# EAGLE design uino-1284p (EAGLE 7.7.0)
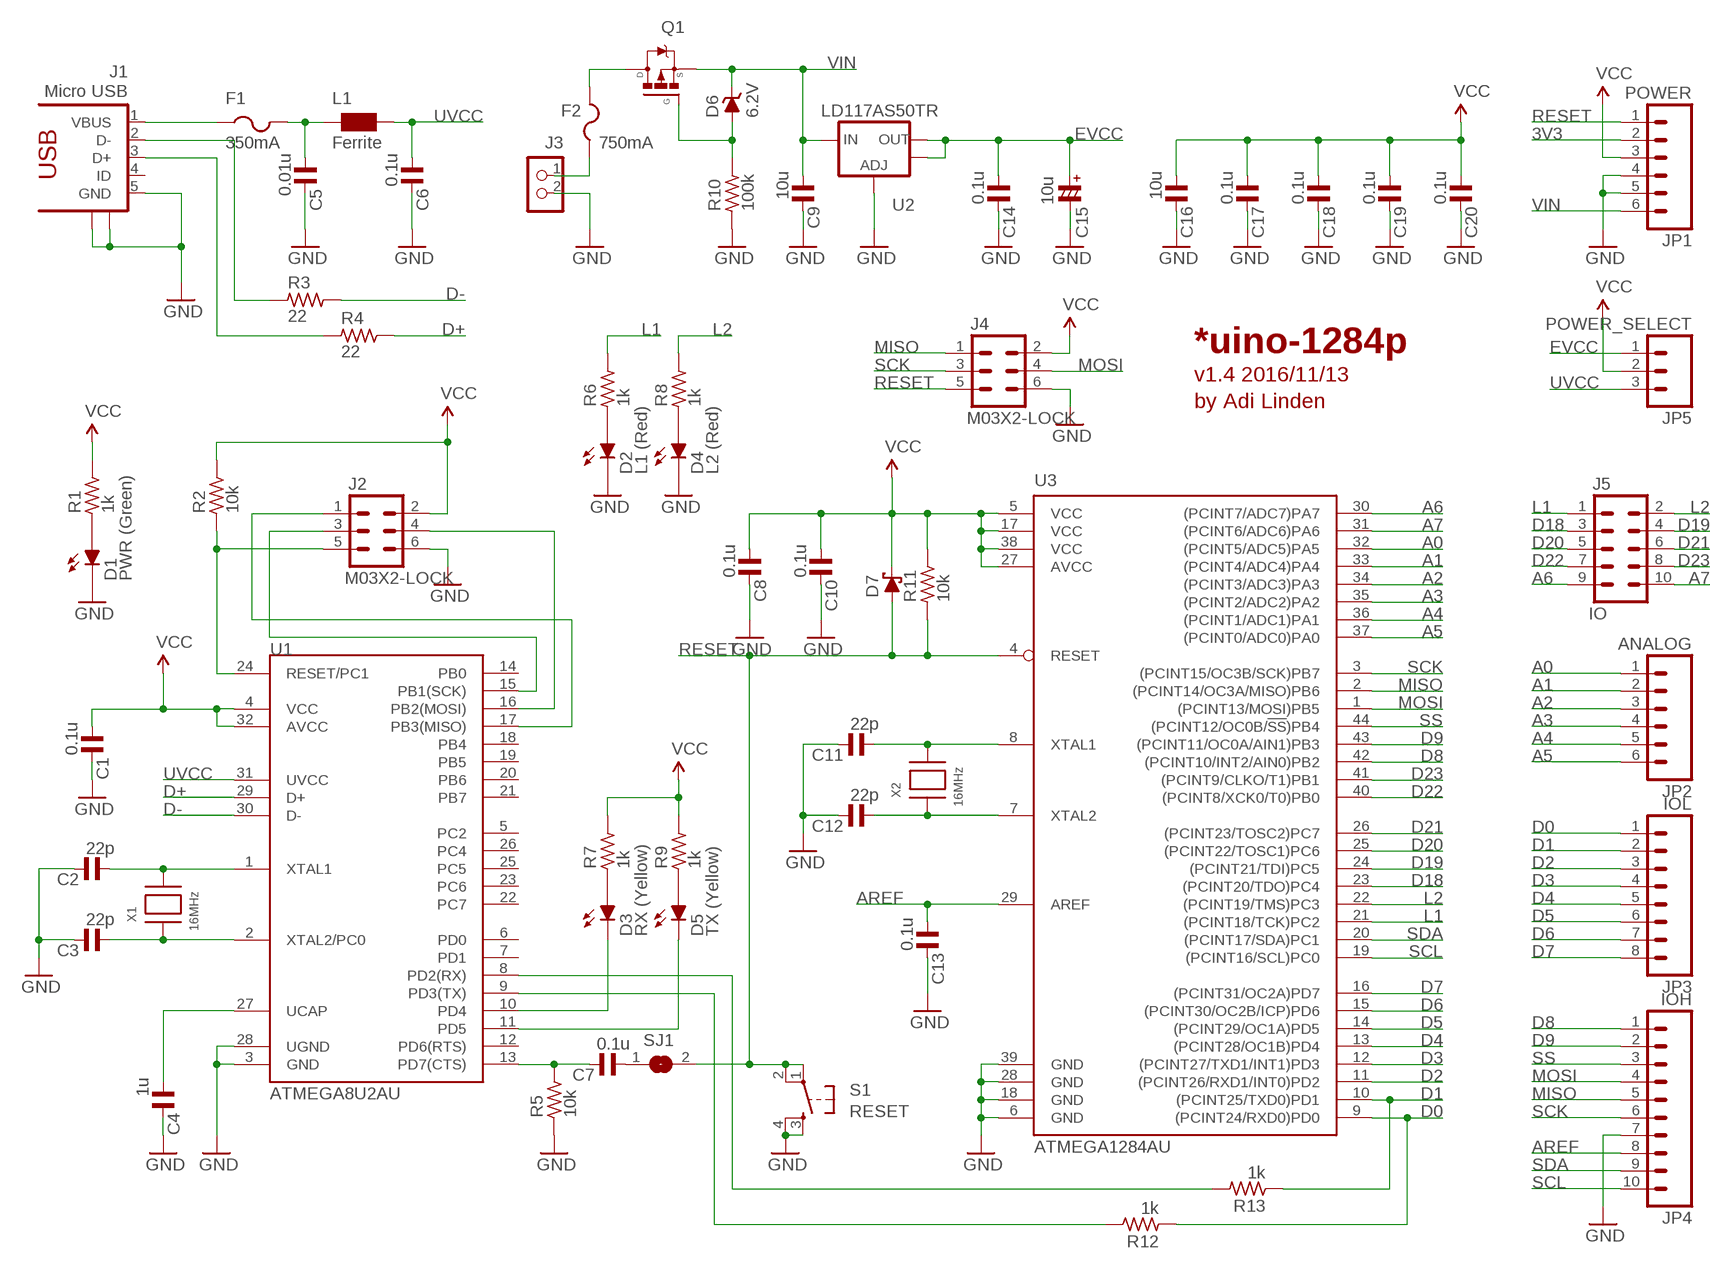
[diagram p0: schematic, sheet 1]

## Parts
C1  0.1u  C_0805MP  [C0805MP]
C2  22p  C_0805MP  [C0805MP]
C3  22p  C_0805MP  [C0805MP]
C4  1u  C_0805MP  [C0805MP]
C5  0.01u  C_0805MP  [C0805MP]
C6  0.1u  C_0805MP  [C0805MP]
C7  0.1u  C_0805MP  [C0805MP]
C8  0.1u  C_0805MP  [C0805MP]
C9  10u  C_0805MP  [C0805MP]
C10  0.1u  C_0805MP  [C0805MP]
C11  22p  C_0805MP  [C0805MP]
C12  22p  C_0805MP  [C0805MP]
C13  0.1u  C_0805MP  [C0805MP]
C14  0.1u  C_0805MP  [C0805MP]
C15  10u  CP_0805MP/T  [C0805MP/T]
C16  10u  C_0805MP  [C0805MP]
C17  0.1u  C_0805MP  [C0805MP]
C18  0.1u  C_0805MP  [C0805MP]
C19  0.1u  C_0805MP  [C0805MP]
C20  0.1u  C_0805MP  [C0805MP]
D1  PWR (Green)  LEDCHIP-LED0805MP  [CHIP-LED0805MP]
D2  L1 (Red)  LEDCHIP-LED0805MP  [CHIP-LED0805MP]
D3  RX (Yellow)  LEDCHIP-LED0805MP  [CHIP-LED0805MP]
D4  L2 (Red)  LEDCHIP-LED0805MP  [CHIP-LED0805MP]
D5  TX (Yellow)  LEDCHIP-LED0805MP  [CHIP-LED0805MP]
D6  6.2V  BZX384  [SOD323]
D7  SCHOTTKY-DIODESOD323  [SOD323]
F1  350mA  PTCFUSE-0805  [R0805]
F2  750mA  PTCFUSE-0805  [R0805]
J1  Micro USB  USB_MICRO_B_2.0-TH  [ZX62D-AB-5P8]
J2  M03X2-LOCK  [2X03_LOCK]
J3  CON_TERMINAL_BLOCK_02-5MM  [TERMINAL_BLOCK_2P_5]
J4  M03X2-LOCK  [2X03_LOCK]
J5  IO  M05X2  [2X05]
JP1  POWER  M06SIP  [1X06]
JP2  ANALOG  M06SIP  [1X06]
JP3  IOL  M081X08  [1X08]
JP4  IOH  M101X10  [1X10]
JP5  POWER_SELECT  M03PTH  [1X03]
L1  Ferrite  WE-CBF_0805  [0805]
Q1  MMBF0202PLT1  [SOT23]
R1  1k  R_0805MP  [R0805MP]
R2  10k  R_0805MP  [R0805MP]
R3  22  R_0805MP  [R0805MP]
R4  22  R_0805MP  [R0805MP]
R5  10k  R_0805MP  [R0805MP]
R6  1k  R_0805MP  [R0805MP]
R7  1k  R_0805MP  [R0805MP]
R8  1k  R_0805MP  [R0805MP]
R9  1k  R_0805MP  [R0805MP]
R10  100k  R_0805MP  [R0805MP]
R11  10k  R_0805MP  [R0805MP]
R12  1k  R_0805MP  [R0805MP]
R13  1k  R_0805MP  [R0805MP]
S1  RESET  TAC_SWITCHSMD  [TACTILE_SWITCH_SMD]
SJ1  SJ  [SJ]
U1  ATMEGA8U2AU  [TQFP32-08]
U2  LD117AS50TR  V_REG_LM1117SOT223  [SOT223]
U3  ATMEGA1284AU  ATMEGA1284P-AU  [TQFP44]
X1  16MHz  XTALNX5032  [NX5032]
X2  16MHz  XTALNX5032  [NX5032]

## Nets
3V3: JP1.2
A0: JP2.1 U3.32((PCINT5/ADC5)PA5)
A1: JP2.2 U3.33((PCINT4/ADC4)PA4)
A2: JP2.3 U3.34((PCINT3/ADC3)PA3)
A3: JP2.4 U3.35((PCINT2/ADC2)PA2)
A4: JP2.5 U3.36((PCINT1/ADC1)PA1)
A5: JP2.6 U3.37((PCINT0/ADC0)PA0)
A6: J5.9 U3.30((PCINT7/ADC7)PA7)
A7: J5.10 U3.31((PCINT6/ADC6)PA6)
AREF: C13.1 JP4.8 U3.29(AREF)
D0: JP3.1 R12.1 U3.9((PCINT24/RXD0)PD0)
D1: JP3.2 R13.1 U3.10((PCINT25/TXD0)PD1)
D2: JP3.3 U3.11((PCINT26/RXD1/INT0)PD2)
D3: JP3.4 U3.12((PCINT27/TXD1/INT1)PD3)
D4: JP3.5 U3.13((PCINT28/OC1B)PD4)
D5: JP3.6 U3.14((PCINT29/OC1A)PD5)
D6: JP3.7 U3.15((PCINT30/OC2B/ICP)PD6)
D7: JP3.8 U3.16((PCINT31/OC2A)PD7)
D8: JP4.1 U3.42((PCINT10/INT2/AIN0)PB2)
D9: JP4.2 U3.43((PCINT11/OC0A/AIN1)PB3)
D18: J5.3 U3.23((PCINT20/TDO)PC4)
D19: J5.4 U3.24((PCINT21/TDI)PC5)
D20: J5.5 U3.25((PCINT22/TOSC1)PC6)
D21: J5.6 U3.26((PCINT23/TOSC2)PC7)
D22: J5.7 U3.40((PCINT8/XCK0/T0)PB0)
D23: J5.8 U3.41((PCINT9/CLKO/T1)PB1)
D+: R4.2 U1.29(D+)
D-: R3.2 U1.30(D-)
EVCC: C14.1 C15.+ JP5.1 U2.2(OUT) U2.4(OUT)
GND: C1.2 C2.2 C3.2 C4.2 C5.2 C6.2 C8.2 C9.2 C10.2 C11.2 C12.2 C13.2 C14.2 C15.- C16.2 C17.2 C18.2 C19.2 C20.2 D1.C D2.C D4.C J1.5(GND) J1.S1 J1.S2 J2.6 J3.2 J4.6 JP1.4 JP1.5 JP4.7 R5.1 R10.1 S1.3 S1.4 U1.3(GND) U1.28(UGND) U2.1(ADJ) U3.6(GND) U3.18(GND) U3.28(GND) U3.39(GND)
L1: J5.1 R6.2 U3.21((PCINT18/TCK)PC2)
L2: J5.2 R8.2 U3.22((PCINT19/TMS)PC3)
MISO: J4.1 JP4.5 U3.2((PCINT14/OC3A/MISO)PB6)
MOSI: J4.4 JP4.4 U3.1((PCINT13/MOSI)PB5)
N$1: F2.2 Q1.3(D)
N$2: C5.1 F1.2 L1.1
N$3: C7.1 SJ1.1
N$4: J1.2(D-) R3.1
N$5: J1.3(D+) R4.1
N$6: R12.2 U1.9(PD3(TX))
N$7: R13.2 U1.8(PD2(RX))
N$8: C2.1 U1.1(XTAL1) X1.P$2
N$9: C3.1 U1.2(XTAL2/PC0) X1.P$1
N$10: C4.1 U1.27(UCAP)
N$11: D2.A R6.1
N$12: D4.A R8.1
N$13: J2.1 U1.17(PB3(MISO))
N$14: J2.3 U1.15(PB1(SCK))
N$15: J2.5 R2.1 U1.24(RESET/PC1)
N$16: J2.4 U1.16(PB2(MOSI))
N$17: F2.1 J3.1
N$18: D6.A Q1.1(G) R10.2
N$23: C11.1 U3.8(XTAL1) X2.P$2
N$24: C12.1 U3.7(XTAL2) X2.P$1
N$26: D3.A R7.1
N$27: D5.A R9.1
N$29: D3.C U1.10(PD4)
N$30: D5.C U1.11(PD5)
N$31: C7.2 R5.2 U1.13(PD7(CTS))
N$34: D1.A R1.1
RESET: D7.A J4.5 JP1.1 R11.1 S1.1 S1.2 SJ1.2 U3.4(RESET)
SCK: J4.3 JP4.6 U3.3((PCINT15/OC3B/SCK)PB7)
SCL: JP4.10 U3.19((PCINT16/SCL)PC0)
SDA: JP4.9 U3.20((PCINT17/SDA)PC1)
SS: JP4.3 U3.44((PCINT12/OC0B/!SS!)PB4)
UVCC: C6.1 JP5.3 L1.2 U1.31(UVCC)
VBUS: F1.1 J1.1(VBUS)
VCC: C1.1 C8.1 C10.1 C16.1 C17.1 C18.1 C19.1 C20.1 D7.C J2.2 J4.2 JP1.3 JP5.2 R1.2 R2.2 R7.2 R9.2 R11.2 U1.4(VCC) U1.32(AVCC) U3.5(VCC) U3.17(VCC) U3.27(AVCC) U3.38(VCC)
VIN: C9.1 D6.C JP1.6 Q1.2(S) U2.3(IN)
Unconnected: J1.4(ID) U1.5(PC2) U1.6(PD0) U1.7(PD1) U1.12(PD6(RTS)) U1.14(PB0) U1.18(PB4) U1.19(PB5) U1.20(PB6) U1.21(PB7) U1.22(PC7) U1.23(PC6) U1.25(PC5) U1.26(PC4)

## Notes on the sheet
- *uino-1284p
- v1.4 2016/11/13
- by Adi Linden

## Library data of the parts
C1-C14 C16-C20 = rc-master-smd:C_: NON-POLARIZED CAP
C15 = rc-master-smd:CP_: POLARIZED CAP
D1-D5 = led:LED: LED Various Types
D6 = diode:BZX384*: ZENER DIODE BZX384
D7 = diode:SCHOTTKY-DIODE: Schottky Diode
F1 F2 = adilinden:PTCFUSE: PTC fuses, resettable thermistors
J1 = adi-misc:USB_MICRO_B_2.0-TH: USB Micro AB OTG Receptacle Hirose ZX62D-AB-5P8 Amphenol FCI 10118194-0001LF
J2 J4 = adi-misc:M03X2: This is a 3x2 pin header Note: This part is based on the Sparkfun M04X2 header.
J3 = adi-misc:CON_TERMINAL_BLOCK_02: 2 poles wire to board terminal block
J5 = adilinden:M05X2
JP1 JP2 = SparkFun:M06: Header 6 Standard 6-pin 0.1" header. Use with straight break away headers (SKU : PRT-00116), right angle break away headers (PRT-00553), swiss pins (PRT-00743), machine pins (PRT-00117), and female headers (PRT-00115). Molex polarized connector foot print use with SKU : PRT-08094 with associated crimp pins and housings. NOTES ON THE VARIANTS LOCK and LOCK_LONGPADS... This footprint was designed to help hold the alignment of a through-hole component (i.e. 6-pin header) while soldering it into place. You may notice that each hole has been shifted either up or down by 0.005 of an inch from it's more standard position (which is a perfectly straight line). This slight alteration caused the pins (the squares in the middle) to touch the edges of the holes. Because they are alternating, it causes a "brace" to hold the component in place. 0.005 has proven to be the perfect amount of "off-center" position when using our standard breakaway headers. Although looks a little odd when you look at the bare footprint, once you have a header in there, the alteration is very hard to notice. Also, if you push a header all the way into place, it is covered up entirely on the bottom side. This idea of altering the position of holes to aid alignment will be further integrated into the Sparkfun Library for other footprints. It can help hold any component with 3 or more connection pins.
JP3 = SparkFun:M08: Header 8 Standard 8-pin 0.1" header. Use with straight break away headers (SKU : PRT-00116), right angle break away headers (PRT-00553), swiss pins (PRT-00743), machine pins (PRT-00117), and female headers (PRT-00115).
JP4 = adilinden:M10: Header 10 Standard 10-pin 0.1" header. Use with straight break away headers (SKU : PRT-00116), right angle break away headers (PRT-00553), swiss pins (PRT-00743), machine pins (PRT-00117), and female headers (PRT-00115). Note: This part is based on the Sparkfun M08 library part.
JP5 = SparkFun:M03: Header 3 Standard 3-pin 0.1" header. Use with straight break away headers (SKU : PRT-00116), right angle break away headers (PRT-00553), swiss pins (PRT-00743), machine pins (PRT-00117), and female headers (PRT-00115). Molex polarized connector foot print use with SKU : PRT-08232 with associated crimp pins and housings.
L1 = wuerth-elektronik:WE-CBF: SMD EMI Suppression Ferrite Beads - excellent anti-EMI properties - low DCR - impedances till 3000 ohms - rated current up to 6 A
Q1 = transistor-fet:MMBF0202P*: P-Channel Power MOSFET
R1-R13 = rc-master-smd:R_: RESISTOR
S1 = SparkFun:TAC_SWITCH: Momentary Switch Button commonly used for reset or general input. Spark Fun Electronics SKU : COM-00097
SJ1 = jumper:SJ: SMD solder JUMPER
U1 = SparkFun:ATMEGA8U2: Atmel 8-bit Microcontroller with 8/16/32K Bystes of ISP Flash and USB Controller. ATmega8U2, ATmega16U2, and ATmega32U2
U2 = adi-misc:V_REG_LM1117: Voltage Regulator LM1117 Standard adjustable voltage regulator but in SMD form. Spark Fun Electronics SKU : COM-00595
U3 = adi-atmega:ATMEGA1284P: 8-bit Microcontroller with 64K Bytes In-System Programmable Flash Source: http://www.atmel.com/dyn/resources/prod_documents/doc2593.pdf; MPN: ATMEGA644PV-10AU; OC_FARNELL: 1455123; OC_NEWARK: 58M3748
X1 X2 = adafruit:XTAL: Low cost SMT crystals, no capacitors included http://www.ladyada.net/library/eagle

## Board
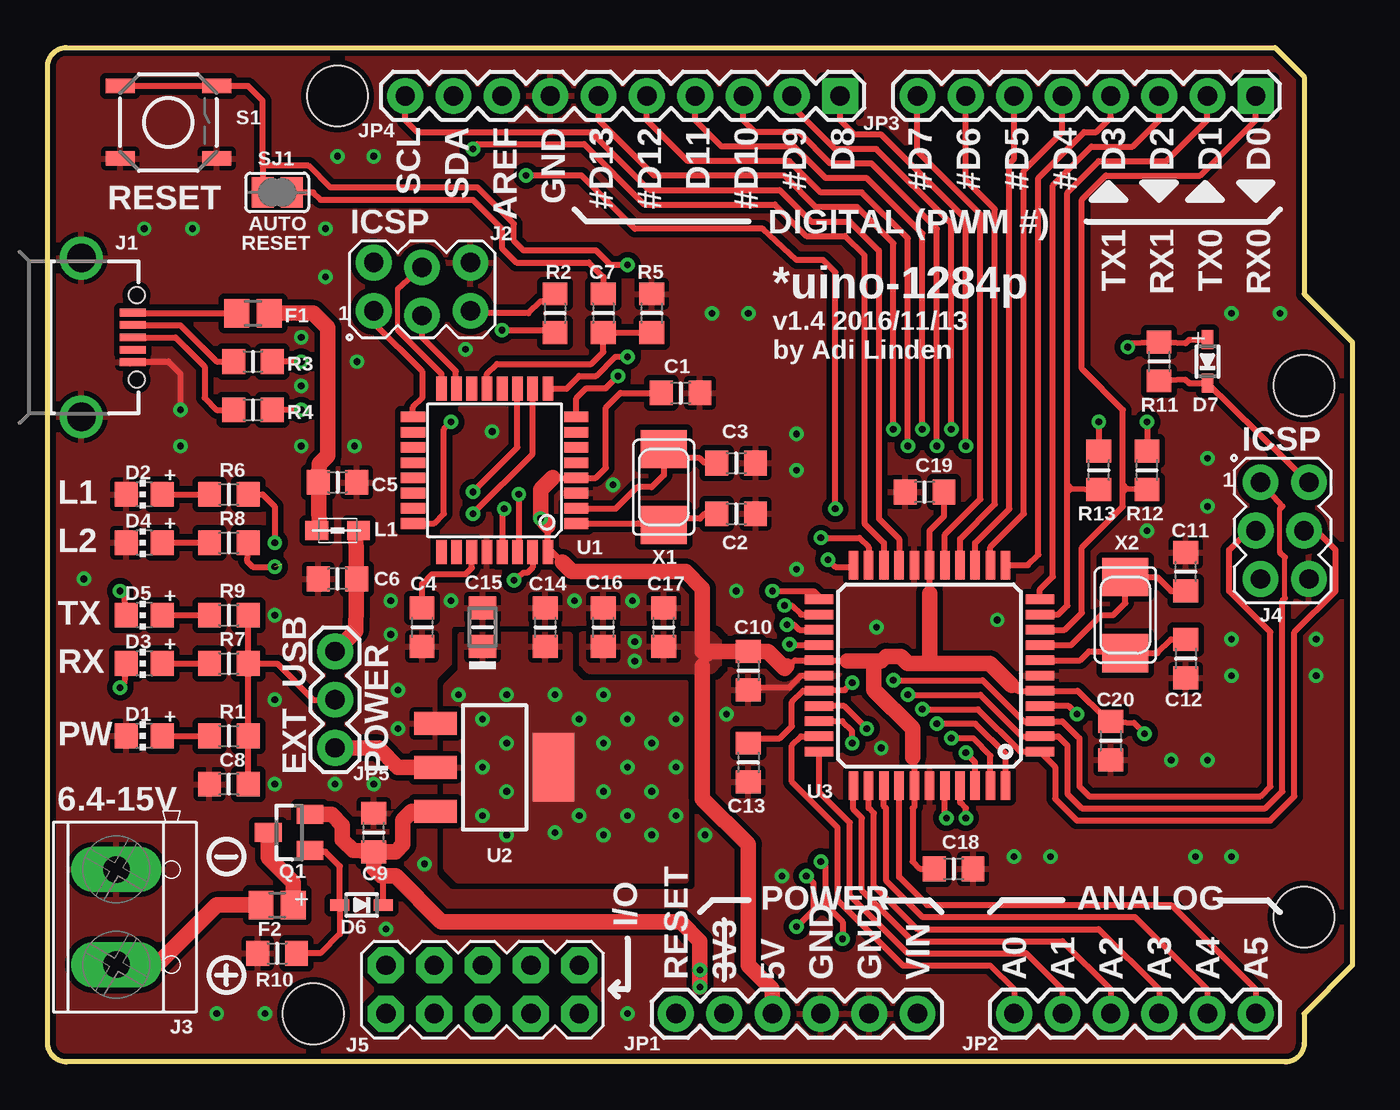
[diagram p1: board, top side]
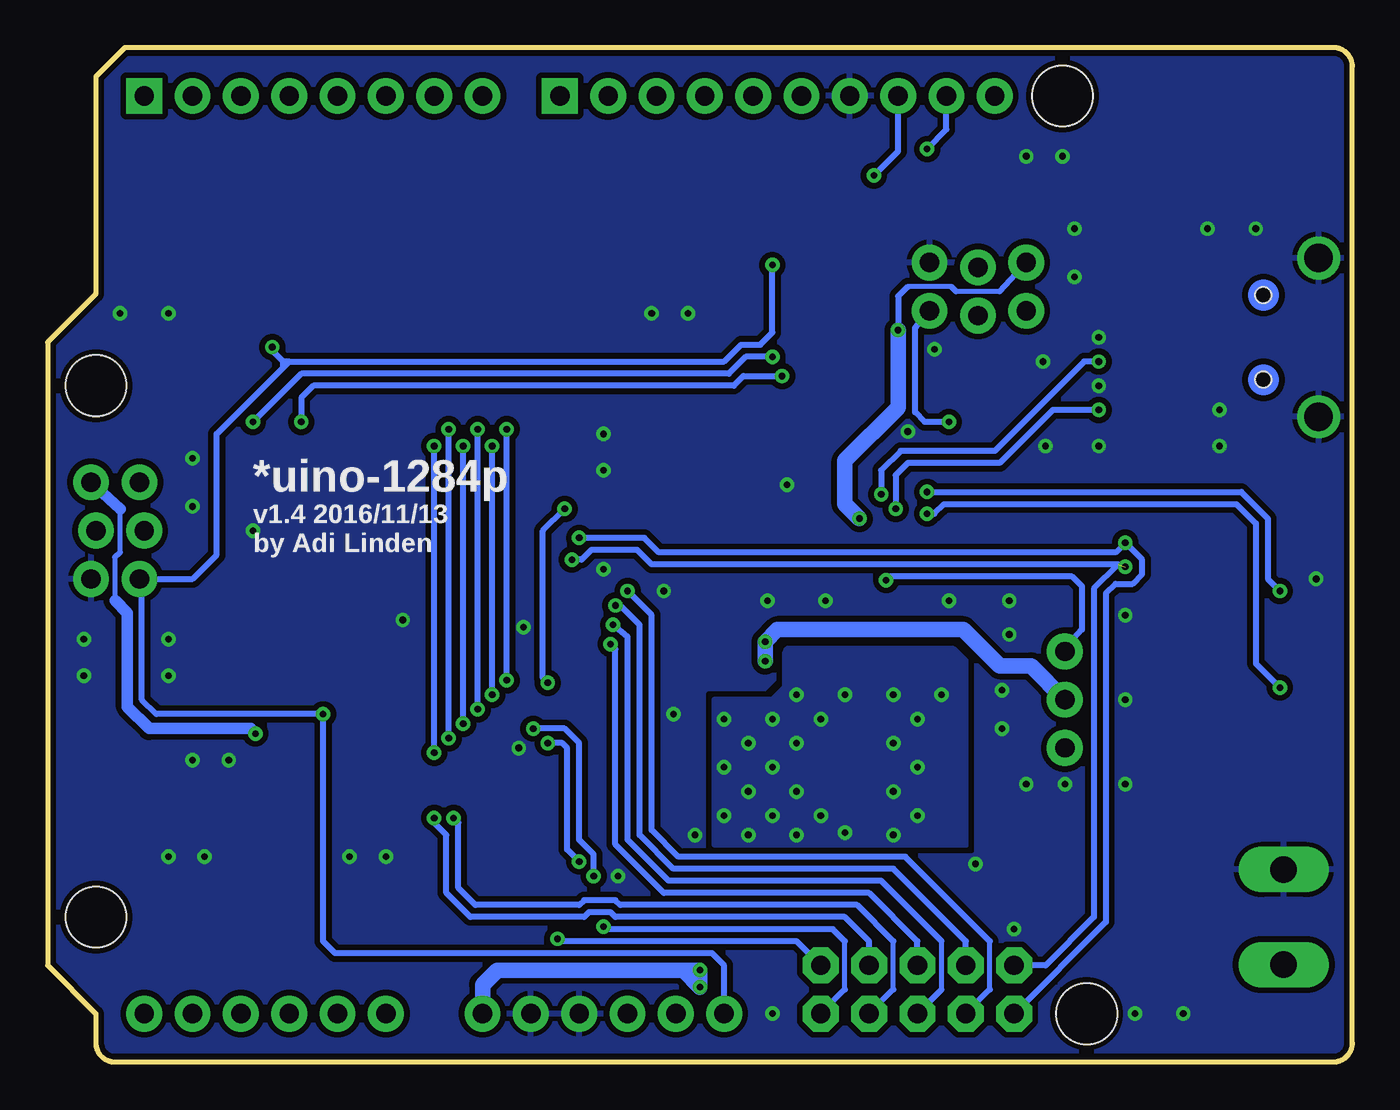
[diagram p2: board, bottom side, seen from below]

Size 68.58 x 53.34 mm. Coordinates in mm from the lower left corner, seen from the top.
Outline: 64.52,53.34 66.04,51.82 66.04,40.39 68.58,37.85 68.58,5.08 66.04,2.54 66.04,1 arc-90 65.04,0 1,0 arc-90 0,1 0,52.34 arc-90 1,53.34 64.52,53.34
Copper layers (1*16): Top 0.035mm / dielectric 1.5mm / Bottom 0.035mm
Design rules "SeeedStudio_2layer_DRU_no_angle_20140221 *": minimum track width 6mil, minimum drill 12mil, track to track 6mil, track to pad 6mil, pad to pad 6mil, via to via 6mil, smd to smd 0mil, copper to edge 10mil, drill to drill 10mil, minimum pad ring 10mil, minimum via ring 8mil, stop-mask expansion 2mil, vias tented up to drill 25mil, thermal gap 10mil
Holes 3.2 mm at 66.04,35.56 66.04,7.62 15.24,50.8 13.97,2.54

### Footprints (pad centres in the part's own frame; a part is rotated, then mirrored left to right if it is on the bottom)
C0805MP = smd 1.2 x 1.3: 1 -1.016,0; 2 1.016,0
C0805MP/T = smd 1.2 x 1.45: + 1.016,0; - -1.016,0
CHIP-LED0805MP = smd 1.3 x 1.2: A 0,-0.953; C 0,0.953
SOD323 = smd 1 x 0.6: A 1.143,0; C -1.143,0
R0805 = smd 1.3 x 1.5: 1 -0.85,0; 2 0.85,0
ZX62D-AB-5P8 = smd 0.4 x 1.35: 1 -1.3,2.7; 2 -0.65,2.7; 3 0,2.7; 4 0.65,2.7; 5 1.3,2.7 | drill 1.5: S1 -4.175,0; S2 4.175,0 | hole 0.85: -2.225,2.9; 2.225,2.9
2X03_LOCK = drill 1.016 pad 1.88: 1 -2.54,-1.143; 2 -2.54,1.397; 3 0,-1.397; 4 0,1.143; 5 2.54,-1.143; 6 2.54,1.397
TERMINAL_BLOCK_2P_5 = drill 1.4 pad 2.38 long: 1 2.5,-0.45; 2 -2.5,-0.45
2X05 = drill 1.016 pad 1.88 octagon: 1 -5.08,-1.27; 2 -5.08,1.27; 3 -2.54,-1.27; 4 -2.54,1.27; 5 0,-1.27; 6 0,1.27; 7 2.54,-1.27; 8 2.54,1.27; 9 5.08,-1.27; 10 5.08,1.27
1X06 = drill 1.016 pad 1.88: 1 0,0; 2 2.54,0; 3 5.08,0; 4 7.62,0; 5 10.16,0; 6 12.7,0
1X08 = drill 1.016 pad 1.88 square: 1 0,0 | drill 1.016 pad 1.88: 2 2.54,0; 3 5.08,0; 4 7.62,0; 5 10.16,0; 6 12.7,0; 7 15.24,0; 8 17.78,0
1X10 = drill 1.016 pad 1.88 square: 1 0,0 | drill 1.016 pad 1.88: 2 2.54,0; 3 5.08,0; 4 7.62,0; 5 10.16,0; 6 12.7,0; 7 15.24,0; 8 17.78,0; 9 20.32,0; 10 22.86,0
1X03 = drill 1.016 pad 1.88: 1 0,0; 2 2.54,0; 3 5.08,0
0805 = smd 1.2 x 1: 1 -1.1,0; 2 1.1,0
SOT23 = smd 1 x 1.4: 1 -0.95,-1.1; 2 0.95,-1.1; 3 0,1.1
R0805MP = smd 1.2 x 1.3: 1 -1.016,0; 2 1.016,0
TACTILE_SWITCH_SMD = smd 1.524 x 0.762: 1 -2.54,1.905; 2 2.54,1.905; 3 -2.54,-1.905; 4 2.54,-1.905
SJ = smd 1.168 x 1.6: 1 -0.762,0; 2 0.762,0
TQFP32-08 = smd 1.27 x 0.559: 1 -4.293,2.8; 2 -4.293,2; 3 -4.293,1.2; 4 -4.293,0.4; 5 -4.293,-0.4; 6 -4.293,-1.2; 7 -4.293,-2; 8 -4.293,-2.8; 17 4.293,-2.8; 18 4.293,-2; 19 4.293,-1.2; 20 4.293,-0.4; 21 4.293,0.4; 22 4.293,1.2; 23 4.293,2; 24 4.293,2.8 | smd 0.559 x 1.27: 9 -2.8,-4.293; 10 -2,-4.293; 11 -1.2,-4.293; 12 -0.4,-4.293; 13 0.4,-4.293; 14 1.2,-4.293; 15 2,-4.293; 16 2.8,-4.293; 25 2.8,4.293; 26 2,4.293; 27 1.2,4.293; 28 0.4,4.293; 29 -0.4,4.293; 30 -1.2,4.293; 31 -2,4.293; 32 -2.8,4.293
SOT223 = smd 1.219 x 2.235: 1 -2.311,-3.099; 2 0,-3.099; 3 2.311,-3.099 | smd 3.6 x 2.2: 4 0,3.099
TQFP44 = smd 1.5 x 0.5: 1 -5.8,4; 2 -5.8,3.2; 3 -5.8,2.4; 4 -5.8,1.6; 5 -5.8,0.8; 6 -5.8,0; 7 -5.8,-0.8; 8 -5.8,-1.6; 9 -5.8,-2.4; 10 -5.8,-3.2; 11 -5.8,-4; 23 5.8,-4; 24 5.8,-3.2; 25 5.8,-2.4; 26 5.8,-1.6; 27 5.8,-0.8; 28 5.8,0; 29 5.8,0.8; 30 5.8,1.6; 31 5.8,2.4; 32 5.8,3.2; 33 5.8,4 | smd 0.5 x 1.5: 12 -4,-5.8; 13 -3.2,-5.8; 14 -2.4,-5.8; 15 -1.6,-5.8; 16 -0.8,-5.8; 17 0,-5.8; 18 0.8,-5.8; 19 1.6,-5.8; 20 2.4,-5.8; 21 3.2,-5.8; 22 4,-5.8; 34 4,5.8; 35 3.2,5.8; 36 2.4,5.8; 37 1.6,5.8; 38 0.8,5.8; 39 0,5.8; 40 -0.8,5.8; 41 -1.6,5.8; 42 -2.4,5.8; 43 -3.2,5.8; 44 -4,5.8
NX5032 = smd 2 x 2.4: P$1 2,0; P$2 -2,0

### Placement (x,y rotation side)
C1  33.27,35.18 0 top
C2  36.2,28.83 0 top
C3  36.2,31.5 0 top
C4  19.68,22.86 270 top
C5  15.24,30.48 0 top
C6  15.24,25.4 180 top
C7  29.21,39.37 270 top
C8  9.53,14.61 180 top
C9  17.14,12.06 90 top
C10  36.83,20.57 270 top
C11  59.82,25.78 90 top
C12  59.82,21.21 270 top
C13  36.83,15.75 270 top
C14  26.16,22.86 90 top
C15  22.86,22.86 270 top
C16  29.21,22.86 90 top
C17  32.38,22.86 90 top
C18  47.62,10.16 0 top
C19  46.1,29.97 180 top
C20  55.88,16.89 270 top
D1  5.08,17.14 90 top
D2  5.08,29.84 90 top
D3  5.08,20.95 90 top
D4  5.08,27.3 90 top
D5  5.08,23.5 90 top
D6  16.51,8.26 180 top
D7  60.96,36.83 90 top
F1  10.79,39.37 0 top
F2  12.06,8.26 0 top
J1  1.78,38.1 270 top
J2  19.68,40.64 0 top
J3  4.06,7.62 270 top
J4  64.9,27.94 270 top
J5  22.86,3.81 0 top
JP1  33.02,2.54 0 top
JP2  50.8,2.54 0 top
JP3  63.5,50.8 180 top
JP4  41.66,50.8 180 top
JP5  15.11,16.51 90 top
L1  15.24,27.94 0 top
Q1  12.7,12.06 90 top
R1  9.53,17.14 0 top
R2  26.67,39.37 270 top
R3  10.79,36.83 0 top
R4  10.79,34.29 0 top
R5  31.75,39.37 270 top
R6  9.53,29.84 0 top
R7  9.53,20.95 0 top
R8  9.53,27.3 0 top
R9  9.53,23.5 0 top
R10  12.06,5.71 0 top
R11  58.42,36.83 270 top
R12  57.78,31.11 90 top
R13  55.24,31.11 90 top
S1  6.35,49.4 0 top
SJ1  12.06,45.72 180 top
U1  23.5,31.11 180 top
U2  23.5,15.49 270 top
U3  46.35,20.32 180 top
X1  32.38,30.23 90 top
X2  56.64,23.5 270 top

### Tracks (layer width: path | path; a pad name or v marks a point on that pad's centre or on a via)
A0
  Top 0.305: U3.32 39.6,17.12 39.12,16.64 39.12,14.73 41.53,12.32 41.53,8.51 44.96,5.08 49.53,5.08 50.8,3.81 JP2.1
A1
  Top 0.305: JP2.2 53.34,3.81 51.44,5.71 45.21,5.71 42.16,8.76 42.16,12.57 40.55,14.18 U3.33
A2
  Top 0.305: JP2.3 55.88,3.81 53.34,6.35 45.47,6.35 42.8,9.02 42.8,12.83 42.35,13.27 U3.34
A3
  Top 0.305: JP2.4 58.42,3.81 55.24,6.99 45.72,6.99 43.43,9.27 43.43,13.08 43.16,13.36 U3.35
A4
  Top 0.305: JP2.5 60.96,3.81 57.15,7.62 45.97,7.62 44.07,9.53 44.07,13.34 43.95,13.45 U3.36
A5
  Top 0.305: U3.37 44.76,9.73 46.23,8.26 59.05,8.26 63.5,3.81 JP2.6
A6  (via drill 0.35)
  Top 0.305: v39.88,9.78 40.26,9.4 40.26,8 v39.37,7.11 | U3.30 41.86,18.72 v43.05,17.53
  Bottom 0.254: 26.67,3.81 26.67,6.35
  Bottom 0.305: v39.37,7.11 39.24,6.99 27.3,6.99 26.67,6.35 | 26.67,3.81 J5.9 | v43.05,17.53 41.4,17.53 40.64,16.76 40.64,11.68 39.88,10.92 v39.88,9.78
A7  (via drill 0.35)
  Top 0.305: v40.64,10.54 40.89,10.29 40.89,8.26 41.78,7.37 v41.78,6.48 | U3.31 41.77,17.92 42.29,17.4 v42.29,16.76
  Bottom 0.305: v41.78,6.48 41.66,6.35 29.21,6.35 J5.10 | v42.29,16.76 41.53,16.76 41.27,16.51 41.27,11.18 v40.64,10.54
AREF  (via drill 0.35)
  Top 0.305: v41.4,29.08 41.4,41.53 40.77,42.16 39.37,42.16 37.59,43.81 30.86,43.81 28.07,46.61 v25.15,46.61 | v42.29,19.94 41.91,19.56 40.59,19.56 U3.29 39.71,19.52 39.12,18.92 39.12,17.65 38.48,17.02 36.89,17.02 C13.1
  Bottom 0.305: JP4.8 23.88,47.88 v25.15,46.61 | v41.4,29.08 42.55,27.94 42.55,20.19 v42.29,19.94
D0
  Top 0.305: U3.9 53.45,22.72 54.36,23.62 54.36,27.05 56.52,29.21 56.52,29.97 | 56.52,29.97 56.52,30.35 | 56.52,30.35 56.52,34.29 54.36,36.45 54.36,45.34 55.63,46.61 60.58,46.61 63.5,49.53 JP3.1 | 56.7,30.16 R12.1 | 56.52,30.35 56.7,30.16 | 56.7,30.16 56.52,29.97
D1
  Top 0.305: U3.10 53.11,23.52 53.59,24 53.59,29.97 | 53.59,29.97 53.59,30.35 | 53.59,30.35 53.59,45.72 55.24,47.37 58.8,47.37 60.96,49.53 JP3.2 | 53.78,30.16 R13.1 | 53.59,30.35 53.78,30.16 | 53.78,30.16 53.59,29.97
D2
  Top 0.305: U3.11 52.16,24.85 52.83,25.53 52.83,46.1 54.86,48.13 57.02,48.13 58.42,49.53 JP3.3
D3
  Top 0.305: U3.12 51.52,26.12 52.07,26.67 52.07,46.48 54.48,48.9 55.12,48.9 55.88,49.66 JP3.4
D4
  Top 0.305: U3.13 49.55,27.08 51.31,28.83 51.31,46.86 53.34,48.9 JP3.5
D5
  Top 0.305: U3.14 48.76,27.29 50.55,29.08 50.55,47.24 50.8,47.5 JP3.6
D6
  Top 0.305: U3.15 47.95,27.51 49.78,29.34 49.78,44.83 48.26,46.35 JP3.7
D7
  Top 0.305: U3.16 47.16,27.72 49.02,29.59 49.02,44.58 45.72,47.88 JP3.8
D8  (via drill 0.35)
  Top 0.305: U3.42 48.76,15.76 v48.26,16.26 | v48.26,32.38 48.26,44.32 43.81,48.77 42.42,48.77 41.66,49.53 JP4.1
  Bottom 0.305: v48.26,16.26 v48.26,32.38
D9  (via drill 0.35)
  Top 0.305: U3.43 49.55,16.1 48.64,17.02 v47.5,17.02 | v47.5,33.27 47.5,44.07 43.56,48.01 41.4,48.01 39.12,50.29 JP4.2
  Bottom 0.305: v47.5,17.02 v47.5,33.27
D18  (via drill 0.35)
  Top 0.305: U3.23 40.55,24.47 40.26,24.77 v38.1,24.77
  Bottom 0.254: 19.05,3.81 19.05,6.35
  Bottom 0.305: 19.05,6.35 23.5,10.79 35.43,10.79 36.83,12.19 36.83,23.5 v38.1,24.77 | 19.05,3.81 J5.3
D19  (via drill 0.35)
  Top 0.305: U3.24 39.6,23.52 39.12,24 v38.73,24
  Bottom 0.305: J5.4 20.32,6.35 24.13,10.16 35.69,10.16 37.47,11.94 37.47,22.99 38.48,24 v38.73,24
D20  (via drill 0.35)
  Top 0.305: U3.25 39.51,22.72 39.24,22.99 v38.86,22.99
  Bottom 0.254: 21.59,3.81 21.59,6.35
  Bottom 0.305: 21.59,6.35 24.77,9.53 35.94,9.53 38.1,11.68 38.1,22.35 v38.86,22.99 | 21.59,3.81 J5.5
D21  (via drill 0.35)
  Top 0.305: U3.26 39.04,21.92 v38.99,21.97
  Bottom 0.305: J5.6 22.86,6.35 25.4,8.89 36.2,8.89 38.73,11.43 38.73,21.72 v38.99,21.97
D22  (via drill 0.35)
  Top 0.305: U3.40 47.16,12.92 v47.24,12.83
  Bottom 0.254: 24.13,3.81 24.13,6.35
  Bottom 0.305: 24.13,3.81 J5.7 | 24.13,6.35 26.04,8.26 38.48,8.26 38.73,8.51 40.39,8.51 40.64,8.26 46.1,8.26 46.99,9.14 46.99,12.57 v47.24,12.83
D23  (via drill 0.35)
  Top 0.305: U3.41 47.95,13.64 48.26,13.34 v48.26,12.83
  Bottom 0.305: J5.8 25.4,6.35 26.67,7.62 38.73,7.62 38.99,7.87 40.13,7.87 40.39,7.62 46.35,7.62 47.62,8.89 47.62,11.94 48.26,12.57 v48.26,12.83
D+  (via drill 0.35)
  Top 0.305: v24,29.08 23.89,28.94 U1.29 | v13.34,34.29 R4.2
  Bottom 0.305: v24,29.08 24,30.86 23.37,31.5 18.54,31.5 15.75,34.29 v13.34,34.29
D-  (via drill 0.35)
  Top 0.305: v24.77,29.84 24.77,26.89 U1.30 | v13.34,36.83 R3.2
  Bottom 0.305: v24.77,29.84 24.77,31.11 23.75,32.13 18.8,32.13 14.1,36.83 v13.34,36.83
EVCC  (via drill 0.35)
  Top 0.813: JP5.1 17.4,16.51 18.41,15.49 U2.2
  other vias: 33.02,18.03 30.48,18.03 27.94,18.03 22.86,18.03 24.13,19.3 26.67,19.3 29.21,16.76 31.75,16.76 33.02,15.49 33.02,12.95 31.75,14.22 31.75,11.94 30.48,15.49 30.48,12.95 29.21,14.22 29.21,11.94 27.94,12.95 24.13,14.22 24.13,11.94 22.86,15.49 24.13,16.76 22.86,12.95 26.67,12.06 21.59,19.3 29.21,19.3
  pour Top (isolate 0.305, rank 2): 21.72,22.48 27.43,22.48 27.43,20.57 28.07,19.94 33.53,19.94 33.53,9.53 21.59,9.53 20.95,10.16 20.95,19.81 21.72,20.57
  pour Bottom (isolate 0.305): 33.53,19.05 33.53,11.43 20.32,11.43 20.32,21.08 20.95,21.72 29.72,21.72 29.84,21.46 29.84,19.68 30.48,19.05
  pour Top (no thermals): 24.77,18.41 24.13,18.41 24.13,12.7 28.57,12.7 28.57,18.41
GND  (via drill 0.35)
  Top 0.305: U3.28 39.62,20.32 38.99,19.68 36.89,19.68 C10.2 | J1.5 4.51,36.83 6.35,36.83 6.99,36.2 v6.99,34.29
  other vias: 43.81,16.51 60.33,10.79 43.56,22.86 52.7,10.79 50.8,10.79 62.23,10.79 59.05,15.88 60.96,15.88 60.96,31.75 60.96,29.21 62.23,39.37 36.83,39.37 34.92,39.37 39.37,31.11 15.11,14.61 15.24,47.62 17.14,47.62 5.08,43.81 7.62,43.81 21.97,37.47 49.91,23.24 62.23,20.32 62.23,22.23 14.61,41.27 39.37,33.02 29.72,30.35 35.69,18.29 17.78,6.99 66.67,22.23 66.67,20.32 64.77,39.37 57.78,27.94 16.26,36.83 13.34,32.38 39.37,25.91 36.2,24.77 34.54,11.94 18.41,17.53 18.03,24.26 30.48,2.54 21.21,24.26 1.91,25.4 13.34,38.1 13.34,35.56 18.03,22.48 30.73,24.26 8.89,2.54 11.94,23.5 38.61,9.78 14.61,43.81 11.94,14.61 27.69,24.26 23.37,33.15 16.13,32.38 6.99,32.38 11.43,2.54 18.41,19.56 11.94,19.05 17.14,14.61 19.81,10.41
  pour Top (isolate 0.305, rank 5): 0,53.34 68.58,53.34 68.58,0 0,0
  pour Bottom (isolate 0.305, rank 5): 0,53.34 68.58,53.34 68.58,0 0,0
L1  (via drill 0.35)
  Top 0.305: U3.21 43.16,27.08 42.67,27.56 v40.64,27.56 | R6.2 11.3,29.84 11.94,29.21 v11.94,27.3
  Bottom 0.305: J5.1 12.95,7.37 12.95,24.64 12.45,25.15 11.56,25.15 11.05,25.65 11.05,26.42 v11.94,27.3 12.45,26.8 36.45,26.8 37.21,27.56 v40.64,27.56
L2  (via drill 0.35)  (1 unrouted)
  Top 0.305: U3.22 42.27,26.04 41.4,26.04 v41.02,26.42 | R8.2 10.47,26.36 10.79,26.04 v11.94,26.04
  Bottom 0.305: J5.2 16.13,5.08 13.59,7.62 13.59,24.89 12.32,26.16 36.83,26.16 37.59,26.92 40.01,26.92 40.51,26.42 v41.02,26.42
MISO  (via drill 0.35)
  Top 0.254: 65.02,24.38 65.02,26.54 | 64.77,26.8 64.77,29.08
  Top 0.305: v45.21,19.3 49.02,19.3 51.21,17.12 U3.2 53.11,17.12 53.59,16.64 53.59,14.1 54.36,13.34 64.01,13.34 64.9,14.22 64.9,24.26 65.02,24.38 | J4.1 64.9,29.21 64.77,29.08 | v45.21,32.38 45.21,43.31 42.8,45.72 40.64,45.72 38.99,47.37 33.66,47.37 31.5,49.53 JP4.5 | 65.02,26.54 64.77,26.8
  Bottom 0.305: v45.21,19.3 v45.21,32.38
MOSI  (via drill 0.35)
  Top 0.305: v45.97,18.54 48.9,18.54 51.12,16.32 U3.1 52.96,15.52 52.96,13.84 54.1,12.7 64.26,12.7 65.53,13.97 65.53,22.61 67.69,24.77 67.69,26.92 66.67,27.94 J4.4 | v45.97,33.27 45.97,43.56 43.05,46.48 40.89,46.48 39.24,48.13 35.43,48.13 34.04,49.53 JP4.4
  Bottom 0.305: v45.97,18.54 v45.97,33.27
N$1
  Top 0.813: F2.2 12.91,9.44 11.6,10.75 Q1.3
N$2
  Top 0.813: F1.2 13.97,39.37 14.73,38.61 14.73,31.88 14.29,31.43 C5.1 14.29,28.09 L1.1
N$3
  Top 0.305: C7.1 29.21,41.27 28.45,42.04 24.64,42.04 23.88,42.8 23.88,43.81 22.35,45.34 14.35,45.34 13.97,45.72 SJ1.1
N$4
  Top 0.305: J1.2 4.49,38.73 6.99,38.73 8.89,36.83 R3.1
N$5
  Top 0.305: J1.3 6.73,38.1 8.26,36.58 8.26,34.92 8.89,34.29 R4.1
N$6  (via drill 0.35)
  Top 0.305: U1.9 27.28,35.41 27.94,36.07 28.83,36.07 29.84,37.08 v30.48,37.08 | v57.78,33.66 R12.2
  Bottom 0.305: v57.78,33.66 55.24,36.2 32.77,36.2 31.88,37.08 v30.48,37.08
N$7  (via drill 0.35)
  Top 0.305: v55.24,33.66 R13.2 | U1.8 27.79,34.9 28.32,35.43 29.34,35.43 v29.97,36.07
  Bottom 0.305: v55.24,33.66 55.24,34.92 54.61,35.56 32.51,35.56 32,36.07 v29.97,36.07
N$8
  Top 0.305: X1.P$2 31.78,27.56 | U1.1 31.03,28.32 X1.P$2 | C2.1 34.54,28.83 34.29,28.57 32.73,28.57 X1.P$2
N$9
  Top 0.305: X1.P$1 31.62,31.46 | X1.P$1 32.38,30.86 31.75,30.23 30.99,30.23 29.84,29.08 27.82,29.08 U1.2 | C3.1 34.54,31.5 34.29,31.75 32.86,31.75 X1.P$1
N$10
  Top 0.305: U1.27 22.3,25.98 21.97,25.65 20.19,25.65 19.68,25.15 C4.1
N$11
  Top 0.305: D2.A R6.1
N$12
  Top 0.305: D4.A R8.1
N$13
  Top 0.305: J2.1 17.14,38.86 19.68,36.32 19.68,34.91 19.2,34.42 U1.17
N$14
  Top 0.305: J2.3 19.68,38.1 21.46,36.32 21.46,35.44 U1.15
N$15  (via drill 0.35)
  Top 0.305: U1.24 20.31,28.32 20.83,28.83 20.83,33.27 v21.21,33.66 | R2.1 26.36,40.01 25.91,40.01 25.27,39.37 22.35,39.37 J2.5
  Bottom 0.305: v21.21,33.66 22.48,33.66 22.99,34.16 22.99,38.61 J2.5
N$16
  Top 0.254: 18.41,38.48 18.41,40.64
  Top 0.305: 18.41,40.64 J2.4 | 20.67,35.43 U1.16 20.7,36.2 18.41,38.48
N$17
  Top 0.813: F2.1 8.89,8.26 5.71,5.08 3.65,5.08 J3.1
N$18
  Top 0.305: R10.2 14.35,5.71 15.37,6.73 D6.A 15.37,10.29 14.61,11.05 13.87,11.05 Q1.1
N$23
  Top 0.305: U3.8 53.8,21.92 55.37,23.5 56.01,23.5 56.64,24.13 X2.P$2 58.33,25.5 59.05,24.77 59.75,24.77 C11.1
N$24
  Top 0.305: U3.7 54.27,21.12 54.74,21.59 56.55,21.59 X2.P$1 58.33,21.5 59.05,22.23 59.75,22.23 C12.1
N$26
  Top 0.305: D3.A R7.1
N$27
  Top 0.305: D5.A R9.1
N$29  (via drill 0.35)
  Top 0.305: U1.10 25.5,31.97 v22.35,28.83 | D3.C 4.03,19.91 v3.81,19.68
  Bottom 0.305: v22.35,28.83 21.97,28.83 21.46,29.34 6.1,29.34 5.08,28.32 5.08,20.95 v3.81,19.68
N$30  (via drill 0.35)
  Top 0.305: U1.11 24.7,32.31 v22.35,29.97 | D5.C 4.03,24.55 v3.81,24.77
  Bottom 0.305: v22.35,29.97 5.84,29.97 4.45,28.57 4.45,25.4 v3.81,24.77
N$31
  Top 0.305: R5.2 C7.2 29.21,37.34 28.57,36.7 23.62,36.7 23.09,36.18 U1.13
N$34
  Top 0.305: D1.A R1.1
RESET  (via drill 0.35)
  Top 0.305: S1.1 S1.2 10.54,51.31 11.3,50.55 11.3,47.12 | 11.3,47.12 SJ1.2 | U3.4 53.67,18.72 v54.1,18.29 | 11.3,47.12 13.72,47.12 14.86,45.97 22.61,45.97 24.51,44.07 24.51,43.18 25.02,42.67 28.83,42.67 29.59,41.91 v30.48,41.91 | D7.A 60,37.97 59.81,37.78 R11.1 56.96,37.78 v56.77,37.59
  Bottom 0.305: 55.88,36.83 33.02,36.83 32.13,37.72 31.11,37.72 30.48,38.35 v30.48,41.91 | 56.2,36.51 55.88,36.83 | 55.88,36.83 56.2,36.83 | 56.2,36.51 56.2,36.83 | 56.2,36.51 59.69,33.02 59.69,26.67 60.96,25.4 J4.5 63.63,25.27 63.63,19.05 62.87,18.29 v54.1,18.29 54.1,6.35 53.47,5.71 33.66,5.71 33.02,5.08 JP1.1 | 56.2,36.83 56.77,37.4 v56.77,37.59
SCK  (via drill 0.35)
  Top 0.305: v44.45,20.07 49.15,20.07 51.3,17.92 U3.3 53.33,17.92 54.23,17.02 54.23,14.48 54.74,13.97 63.75,13.97 64.26,14.48 64.26,22.61 62.1,24.77 62.1,26.92 63.12,27.94 J4.3 | v44.45,33.27 44.45,43.05 42.55,44.96 40.39,44.96 38.73,46.61 31.88,46.61 28.96,49.53 JP4.6
  Bottom 0.305: v44.45,20.07 v44.45,33.27
SCL
  Top 0.305: U3.19 44.76,27.51 43.69,28.57 43.69,42.67 42.16,44.2 40.13,44.2 38.48,45.85 31.62,45.85 28.57,48.9 19.43,48.9 18.8,49.53 JP4.10
SDA  (via drill 0.35)
  Top 0.305: U3.20 43.95,27.29 42.93,28.32 42.93,42.42 41.91,43.43 39.88,43.43 38.23,45.09 31.37,45.09 28.19,48.26 22.61,48.26 v22.35,48.01
  Bottom 0.305: JP4.9 21.34,49.02 v22.35,48.01
SS  (via drill 0.35)
  Top 0.305: U3.44 50.35,16.19 48.77,17.78 v46.74,17.78 | v46.74,32.38 46.74,43.81 43.31,47.24 41.15,47.24 39.5,48.9 37.21,48.9 36.58,49.53 JP4.3
  Bottom 0.305: v46.74,17.78 v46.74,32.38
UVCC  (via drill 0.35)
  Top 0.305: U1.31 25.5,26 25.21,25.72 25.02,25.72 v24.51,25.34
  Top 0.813: L1.2 16.19,27.79 C6.1 16.19,22.67 JP5.3
  Bottom 0.305: JP5.3 15.24,21.59 14.22,22.73 14.22,25.02 14.73,25.53 24.32,25.53 v24.51,25.34
VBUS
  Top 0.305: J1.1 4.51,39.37 F1.1
VCC  (via drill 0.35)
  Top 0.305: R7.2 R9.2 | R7.2 R1.2 C8.1 | U1.32 26.3,27.81 26.29,28.19 | 26.54,30.73 26.56,30.71 U1.4 28.81,30.71 29.34,31.24 29.34,34.42 30.1,35.18 C1.1 | 50.67,19.81 50.97,19.52 U3.5 54.14,19.52 55.5,18.16 55.56,18.16 C20.1 57.09,17.84 v57.66,17.27 | 46.35,24.64 U3.17 46.35,27.94 47.12,28.7 C19.1 | 42.04,21.08 42,21.12 U3.27 39.28,21.12 38.86,20.83 | 45.47,16 45.55,15.91 U3.38 45.55,13.42 45.47,13.34 45.47,10.54 45.85,10.16 C18.1 | R11.2 59.81,35.88 60,35.69 D7.C J4.2 | v23.88,38.48 26.61,38.48 R2.2 | 26.45,26.67 U1.32 | R7.2 12.06,20.95 13.97,19.05 JP5.2 | U1.32 26.52,26.82 27.05,26.29
  Top 0.813: 26.29,28.19 v25.91,28.57 25.91,30.1 26.54,30.73 | 50.67,19.81 49.53,20.95 46.35,20.95 | 42.04,21.08 43.43,21.08 | 43.43,21.08 43.81,21.08 44.07,21.34 44.83,21.34 45.21,20.95 46.35,20.95 | 43.43,21.08 43.43,19.56 45.47,17.53 45.47,16 | 46.35,20.95 46.35,24.64 | 34.42,20.83 34.42,13.84 36.83,11.43 36.83,5.08 38.1,3.81 JP1.3 | 38.86,20.83 38.73,20.7 37.85,21.59 C10.1 34.42,21.59 | 34.42,21.59 34.42,24.89 33.53,25.78 27.56,25.78 27.05,26.29 | 34.42,21.59 34.67,21.46
  Bottom 0.254: 18.54,40.51 20.83,40.51 | 21.08,40.77 23.37,40.77 | 65.02,24.26 65.02,26.54 | 64.77,26.8 64.77,29.08
  Bottom 0.305: J2.2 18.54,40.51 | v23.88,38.48 23.88,40.26 23.37,40.77 | 20.83,40.51 21.08,40.77 | 65.02,26.54 64.77,26.8
  Bottom 0.61: v57.66,17.27 57.91,17.53 63.25,17.53 64.39,18.67 64.39,23.62 65.02,24.26 | 64.77,29.08 J4.2
  Bottom 0.813: v23.88,38.48 23.88,34.42 26.67,31.62 26.67,29.34 v25.91,28.57 | JP5.2 16.89,20.83 18.54,20.83 20.45,22.73 30.23,22.73 v30.86,22.1 v30.86,21.08
  pour Top: 28.07,22.48 28.07,20.95 28.45,20.57 34.92,20.57 35.31,20.95 35.31,22.1 34.92,22.48
VIN  (via drill 0.35)
  Top 0.305: D6.C 17.65,9.65 17.53,9.78
  Top 0.813: C9.1 16.06,11.12 15.49,11.68 15.49,12.45 14.93,13.02 Q1.2 | v34.29,3.94 34.29,6.35 33.27,7.37 20.7,7.37 18.29,9.78 17.53,9.78 17.14,10.16 C9.1 | C9.1 18.29,11.05 18.67,11.43 18.67,12.7 19.15,13.18 U2.3
  Bottom 0.813: JP1.6 45.72,4.06 44.96,4.83 35.18,4.83 | 35.18,4.83 v34.29,3.94 | 35.18,4.83 v34.29,4.83 34.29,4.06

### Text on the board
tPlace: SCL | SDA | AREF | GND | #D13 | #D12 | D11 | #D10 | #D9 | D8 | #D7 | #D6 | #D5 | #D4 | D3 | D2 | D1 | D0 | RESET | AUTO | ICSP | DIGITAL (PWM #) | TX1 | RX1 | TX0 | RX0 | RESET | 1 | *uino-1284p | v1.4 2016/11/13 | + | by Adi Linden | ICSP | 1 | + | L1 | + | L2 | + | TX | + | POWER | RX | USB | + | PW | EXT | 6.4-15V | + | POWER | ANALOG | I/O | RESET | 3V3 | 5V | GND | GND | VIN | A0 | A1 | A2 | A3 | A4 | A5
bPlace: *uino-1284p | v1.4 2016/11/13 | by Adi Linden